# EasyEDA Pro project mipi转接板.eprj

# Schematic Schematic1
Board Name: Board1; Create Date: 2026-05-06; Page Name: P1; Project Name: mipi转接板; Schematic Name: Schematic1; Update Date: 2026-05-06; Company: 嘉立创EDA; Page Size: A4; Version: V1.0
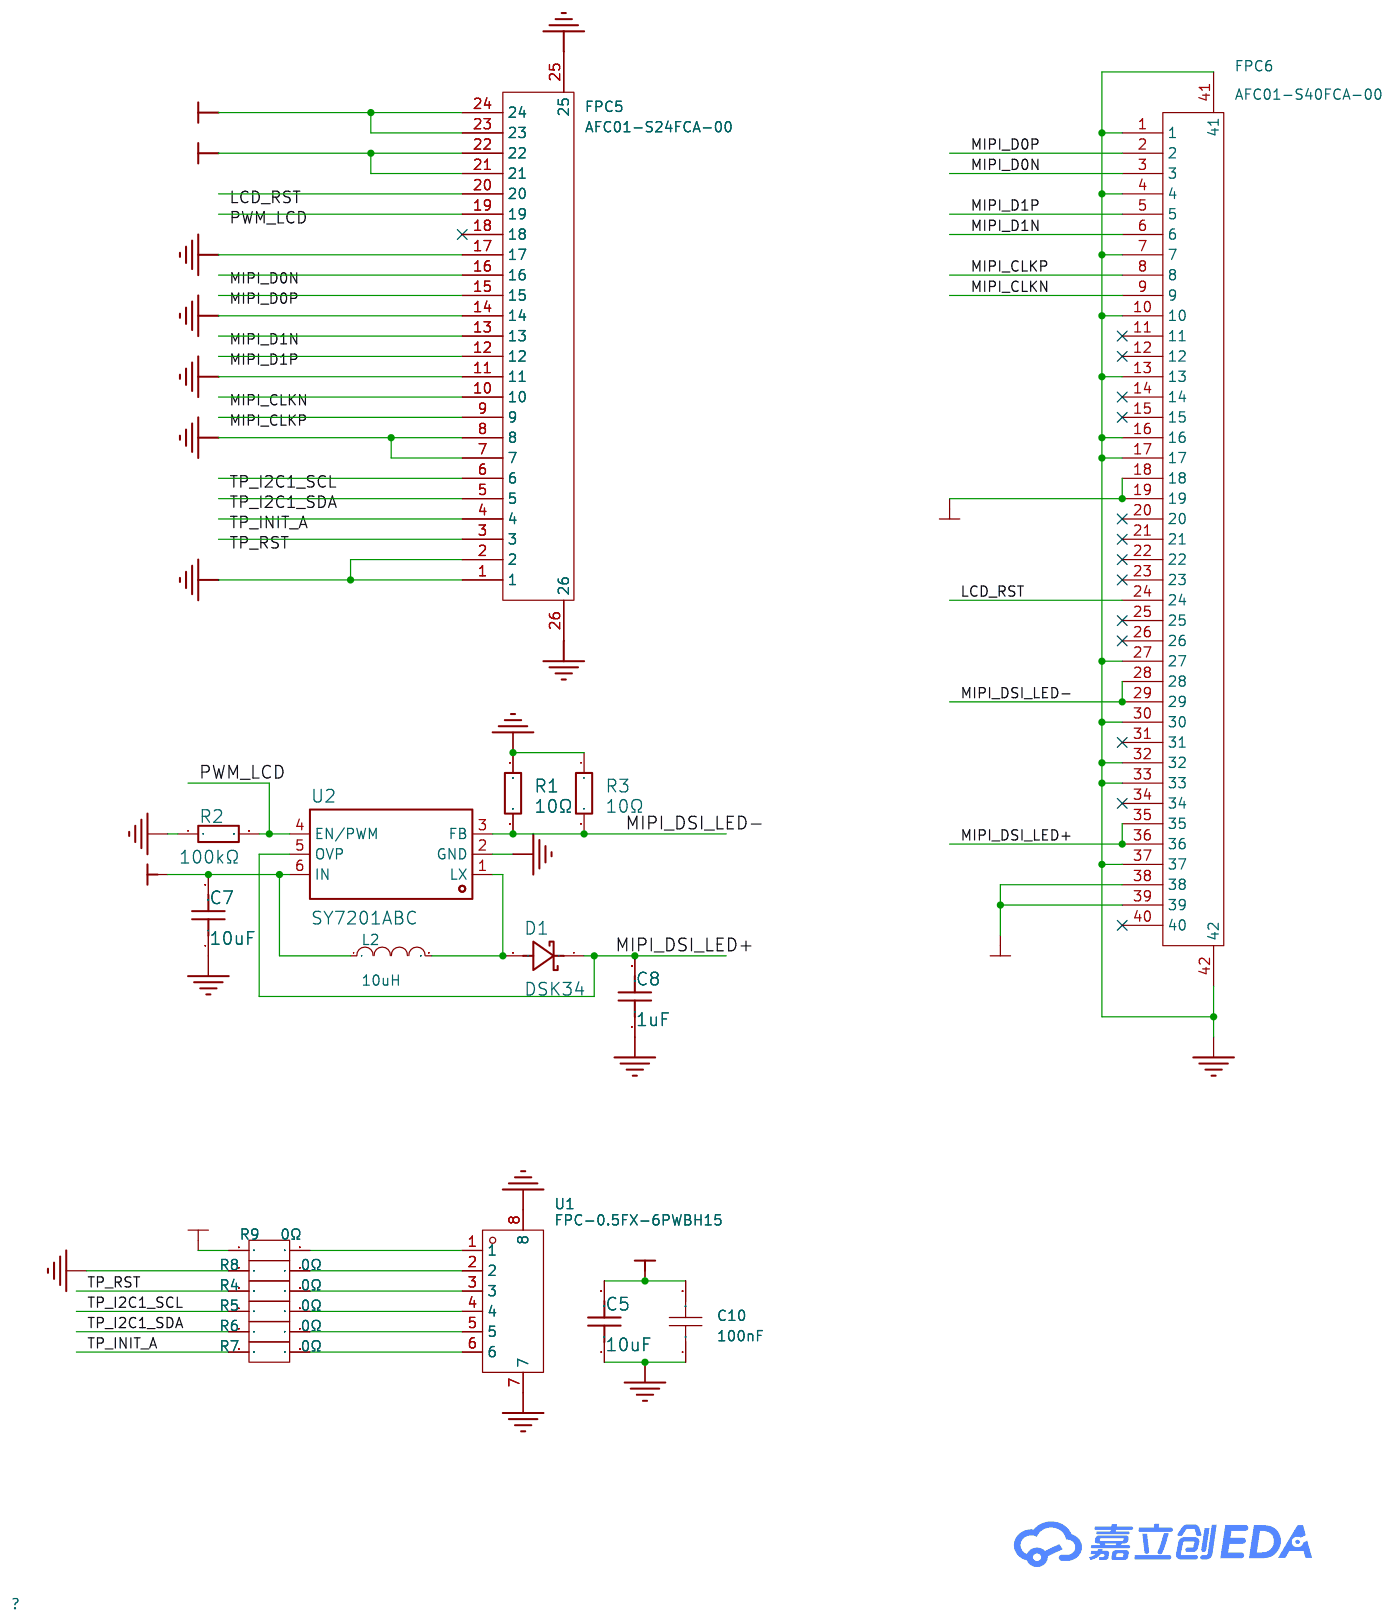
[diagram p0: schematic sheet]

## Parts
C5  10uF  [C0805]
C7  10uF  [C0805]
C8  1uF  [C0805]
C10  100nF  [C0805]
D1  DSK34  [SOD-123_L2.8-W1.8-LS3.7-RD]
FPC5  AFC01-S24FCA-00  [FPC-SMD_24P-P0.50_AFC01-S24FCA-00]
FPC6  AFC01-S40FCA-00  [FPC-SMD_AFC01-S40FCA-00]
L2  10uH  [IND-SMD_L7.3-W6.8]
R1  10Ω  [R0805]
R2  100kΩ  [R0805]
R3  10Ω  [R0805]
R4  0Ω  [R0805]
R5  0Ω  [R0805]
R6  0Ω  [R0805]
R7  0Ω  [R0805]
R8  0Ω  [R0805]
R9  0Ω  [R0805]
U1  FPC-0.5FX-6PWBH15  [FPC-SMD_XUNPU_FPC-0.5FX-6PWBH15]
U2  SY7201ABC  [SOT-23-6_L2.9-W1.6-P0.95-LS2.8-BR]

## Library data of the parts
C5 C7 = CL21A106KAYNNNE_C15850: 容值:10uF;精度:±10%;额定电压:25V;温度系数:X5R;; LCSC Part Name: 10uF ±10% 25V; Supplier Part: C15850; Manufacturer: SAMSUNG(三星); Manufacturer Part: CL21A106KAYNNNE; Supplier Footprint: 0805; JLCPCB Part Class: Basic Part; Datasheet: https://item.szlcsc.com/datasheet/CL21A106KAYNNNE/16532.html; Supplier: LCSC; Tolerance: ±10%; Voltage Rating: 25V; Temperature Coefficient: X5R
C8 = CL21B105KBFNNNE: 容值:1uF;精度:±10%;额定电压:50V;温度系数:X7R;; LCSC Part Name: 1uF ±10% 50V; Supplier Part: C28323; Manufacturer: SAMSUNG(三星); Supplier Footprint: 0805; JLCPCB Part Class: Basic Part; Datasheet: https://item.szlcsc.com/datasheet/CL21B105KBFNNNE/29074.html; Supplier: LCSC; Tolerance: ±10%; Voltage Rated: 50V; Temperature Coefficient: X7R; Voltage Rating: 50V
C10 = C0805S104K5RACAUTO: LCSC Part Name: 100nF ±10% 50V; Supplier Part: C2172699; Manufacturer: KEMET(基美); Supplier Footprint: 0805; JLCPCB Part Class: Extended Part; Datasheet: https://item.szlcsc.com/datasheet/C0805S104K5RACAUTO/2264765.html; Supplier: LCSC; Tolerance: ±10%; Voltage Rating: 50V; Temperature Coefficient: X7R
D1 = DSK34: LCSC Part Name: 电压:40V 电流:3A; Supplier Part: C908230; Manufacturer: FUXINSEMI(富芯森美); Supplier Footprint: SOD-123; JLCPCB Part Class: 扩展库; Datasheet: https://atta.szlcsc.com/upload/public/pdf/source/20201027/C908230_5B73A4E0F076D2A690D7C134AB43D23C.pdf; Supplier: LCSC; Forward Voltage (Vf@If): 550mV@3A; Reverse Voltage (Vr): 40V; Average Rectified Current (Io): 3A; Reverse Leakage Current (Ir): 500nA
FPC5 = AFC01-S24FCA-00: 锁定特性:翻盖式;触点类型:下接;触点数量:24P;间距:0.5mm;安装类型:卧贴;; LCSC Part Name: 间距:0.5mm P数:24P 翻盖式 下接; Supplier Part: C262669; Manufacturer: JS(钜硕电子); Supplier Footprint: SMD,P=0.5mm,卧贴; JLCPCB Part Class: 扩展库; Datasheet: https://atta.szlcsc.com/upload/public/pdf/source/20190816/C413942_2A72D1AC756EAE17EEDF756A339D4500.pdf; Supplier: LCSC; Locking Feature: 翻盖式; Contact Type: 下接; Number of Contacts: 24P; Pitch: 0.5mm; Mounting Type: 卧贴; FFC, FCB Thickness: 0.3mm; Height Above Board: 2mm
FPC6 = AFC01-S40FCA-00: LCSC Part Name: 翻盖式 下接 P数:40P 间距:0.5mm; Supplier Part: C262674; Manufacturer: JS(钜硕电子); Supplier Footprint: SMD,P=0.5mm,卧贴; JLCPCB Part Class: 扩展库; Datasheet: https://item.szlcsc.com/datasheet/AFC01-S40FCA-00/253933.html; Supplier: LCSC; Locking Feature: 翻盖式; Contact Type: 下接; Number of Contacts: 40P; Pitch: 0.5mm; Mounting Type: 卧贴; FFC, FCB Thickness: 0.3mm; Height Above Board: 2mm; Contact Material: 铜合金; Contact Plating: 锡; Operating Temperature: -45℃~+85℃; Rated Voltage (Max): 50V; Current Rating (Max): 500mA
L2 = FXL0630-100-M: 电感值:10uH;精度:±20%;额定电流:4.5A;饱和电流(Isat):5.5A;类型:一体成型电感;; LCSC Part Name: 10uH ±20% 5.5A; Supplier Part: C167223; Manufacturer: cjiang(长江微电); Supplier Footprint: SMD,6.6x7mm; JLCPCB Part Class: 扩展库; Datasheet: https://atta.szlcsc.com/upload/public/pdf/source/20240426/3189EA8206330E2108542F9E34E540E7.pdf; Supplier: LCSC; Tolerance: ±20%; Rated Current: 4.5A; Saturation Current (Isat): 5.5A; DC Resistance (DCR): 68mΩ; Type: 一体成型电感
R1 R3 = 0603WAF360KT5E: LCSC Part Name: 3.6Ω ±1% 100mW 厚膜电阻; Supplier Part: C23015; Manufacturer: UNI-ROYAL(厚声); Supplier Footprint: 0603; JLCPCB Part Class: Extended Part; Datasheet: https://atta.szlcsc.com/upload/public/pdf/source/20200306/C422600_1E6D84923E4A46A82E41ADD87F860B5C.pdf; Supplier: LCSC; Type: 厚膜电阻; Tolerance: ±1%; Power(Watts): 100mW; Overload Voltage (Max): 75V; Temperature Coefficient: ±400ppm/℃; Operating Temperature Range: -55℃~+155℃
R2 = 0805W8F1003T5E: 电阻类型:厚膜电阻;阻值:100kΩ;精度:±1%;功率:125mW;工作电压:150V;温度系数:±100ppm/℃;; LCSC Part Name: 100kΩ ±1% 125mW 厚膜电阻; Supplier Part: C149504; Manufacturer: UNI-ROYAL(厚声); Supplier Footprint: 0805; JLCPCB Part Class: Basic Part; Datasheet: https://item.szlcsc.com/datasheet/0805W8F1003T5E/160838.html; Supplier: LCSC; Type: 厚膜电阻; Tolerance: ±1%; Power(Watts): 125mW; Voltage-Supply(Max): 150V; Temperature Coefficient: ±100ppm/℃; Operating Temperature: -55℃~+155℃
R4-R9 = RE0805FAR000: LCSC Part Name: 0Ω 0.5W 0805 ±1%; Supplier Part: C51934133; Manufacturer: JIERR(捷而瑞); Supplier Footprint: 0805; JLCPCB Part Class: 扩展库; Datasheet: https://item.szlcsc.com/datasheet/RE0805FAR000/54649545.html; Supplier: LCSC; Type: 合金电阻; Tolerance: ±1%; Power(Watts): 500mW; Temperature Coefficient: ±50ppm/℃; Mounting Type: 贴片
U1 = FPC-0.5FX-6PWBH15: LCSC Part Name: 0.5mm P数:6 翻盖式 下接 H1.5; Supplier Part: C3446025; Manufacturer: XUNPU(讯普); Supplier Footprint: SMD,P=0.5mm; Datasheet: https://atta.szlcsc.com/upload/public/pdf/source/20220630/A8197E0740085DD1C1C2DD48EC1382D5.pdf; Supplier: LCSC
U2 = SY7201ABC: 拓扑结构:升压;; Supplier Part: C82173; Manufacturer: Silergy(矽力杰); Supplier Footprint: SOT-23-6; JLCPCB Part Class: Extended Part; Datasheet: https://item.szlcsc.com/datasheet/SY7201ABC/83328.html; Supplier: LCSC; Topology: 升压

## Nets
GND: C5.1 C7.1 C8.1 C10.1 FPC5.1 FPC5.2 FPC5.7 FPC5.8 FPC5.11 FPC5.14 FPC5.17 FPC5.25 FPC5.26 FPC6.1 FPC6.4 FPC6.7 FPC6.10 FPC6.13 FPC6.16 FPC6.17 FPC6.27 FPC6.30 FPC6.32 FPC6.33 FPC6.37 FPC6.41 FPC6.42 R1.1 R2.1 R3.1 R8.1 U1.7 U1.8 U2.2(GND)
VCC_3V3: C5.2 C7.2 C10.2 FPC5.21 FPC5.22 FPC6.18 FPC6.19 FPC6.38 FPC6.39 L2.1 R9.1 U2.6(IN)
VCC_5V: FPC5.23 FPC5.24
LCD_RST: FPC5.20 FPC6.24
MIPI_CLKN: FPC5.10 FPC6.9
MIPI_CLKP: FPC5.9 FPC6.8
MIPI_D0N: FPC5.16 FPC6.3
MIPI_D0P: FPC5.15 FPC6.2
MIPI_D1N: FPC5.13 FPC6.6
MIPI_D1P: FPC5.12 FPC6.5
MIPI_DSI_LED+: C8.2 D1.1(K) FPC6.35 FPC6.36 U2.5(OVP)
MIPI_DSI_LED-: FPC6.28 FPC6.29 R1.2 R3.2 U2.3(FB)
PWM_LCD: FPC5.19 R2.2 U2.4(EN/PWM)
TP_I2C1_SCL: FPC5.6 R5.1
TP_I2C1_SDA: FPC5.5 R6.1
TP_INIT_A: FPC5.4 R7.1
TP_RST: FPC5.3 R4.1
$1N657: D1.2(A) L2.2 U2.1(LX)
$1N1132: R9.2 U1.1
$1N1142: R8.2 U1.2
$1N1152: R7.2 U1.6
$1N1156: R6.2 U1.5
$1N1161: R5.2 U1.4
$1N1166: R4.2 U1.3

Not connected (* = marked no-connect by the designer): FPC5 18*; FPC6 11* 12* 14* 15* 20* 21* 22* 23* 25* 26* 31* 34* 40*

# Board PCB1
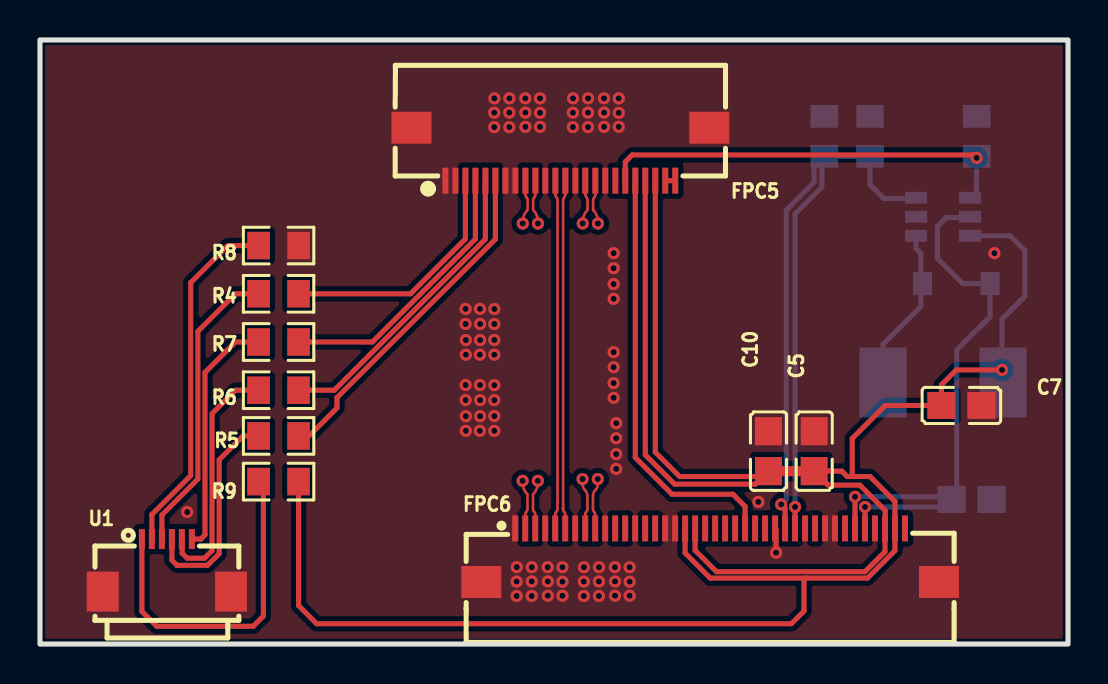
[diagram p1: board, top side]
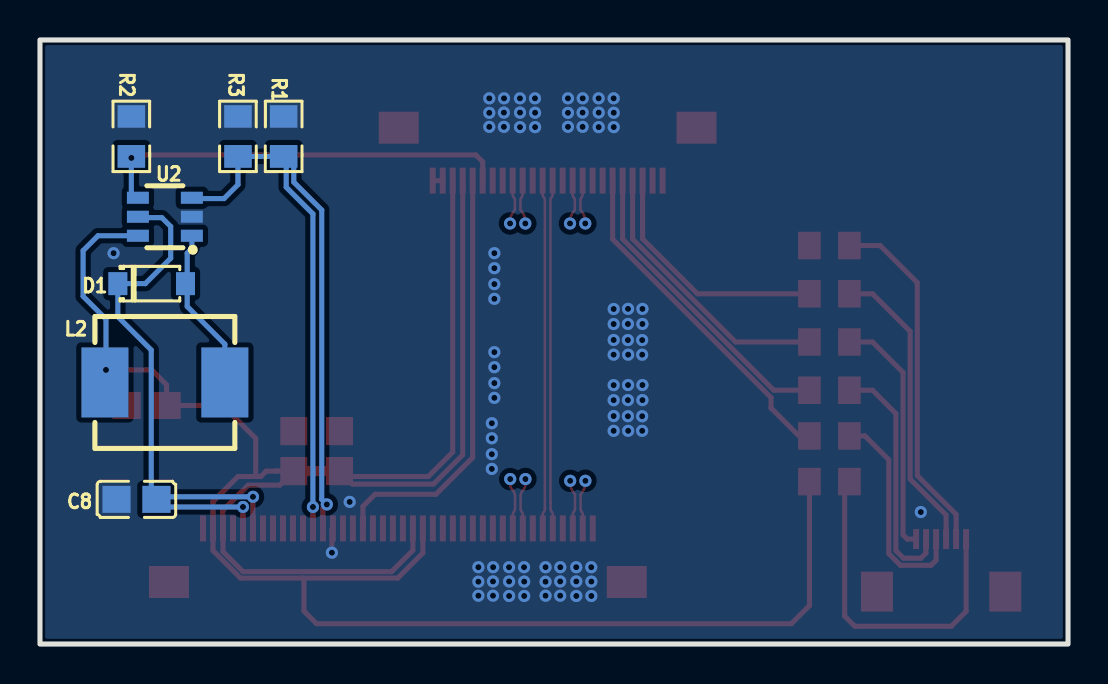
[diagram p2: board, bottom side, seen from below]

Outline 51.44 x 30.23 mm; copper layers: Top Layer, Inner1, Inner2, Bottom Layer. Coordinates in mm from the lower left corner of the outline.
Outline path: rectangle 0,30.23 51.44,0
Stack: Top Layer 0.035mm 外层铜厚1oz / Dielectric1 0.2104mm 7628 RC49% 8.6mil / Inner1 0.0152mm 内层铜厚 / Dielectric2 1.065mm 1.1mm H/HOZ Copper / Inner2 0.0152mm 内层铜厚 / Dielectric3 0.2104mm 7628 RC49% 8.6mil / Bottom Layer 0.035mm 外层铜厚1oz

## Design rules (mm)
net MIPI_CLKP: MIPI_CLK
net MIPI_CLKN: MIPI_CLK
net MIPI_D1P: DP1
net MIPI_D1N: DP1
net MIPI_D0P: MIPI_D0
net MIPI_D0N: MIPI_D0
template: 自定义配置
spacing copperThickness1oz (default): track to track 0.102, other pairs 0.152 to 0.3
spacing copperThickness2oz: track to track 0.203, other pairs 0.152 to 0.3
track width copperThickness1oz (default): min 0.127, default 0.254, max 2.54
track width copperThickness2oz: min 0.203, default 0.254, max 2.54
differential pair differentialPair (default): width min 0.127, default 0.254, max 2.54; gap min 0.152, default 0.152
via viaSize (default): diameter min 0.5, default 0.61, max 10; hole min 0.3, default 0.305, max 6.3

## Placement (name value [footprint] x y rotation side)
C5  10uF  [C0805]  38.73 9.65 270 top
C7  10uF  [C0805]  46.1 11.94 180 top
C8  1uF  [C0805]  46.61 7.24 180 bottom
C10  100nF  [C0805]  36.45 9.65 270 top
D1  DSK34  [SOD-123_L2.8-W1.8-LS3.7-RD]  45.85 18.03 180 bottom
FPC5  AFC01-S24FCA-00  [FPC-SMD_24P-P0.50_AFC01-S24FCA-00]  26.03 24.51 180 top
FPC6  AFC01-S40FCA-00  [FPC-SMD_AFC01-S40FCA-00]  33.53 4.44 0 top
L2  10uH  [IND-SMD_L7.3-W6.8]  45.19 13.09 180 bottom
R1  10Ω  [R0805]  39.24 25.4 270 bottom
R2  100kΩ  [R0805]  46.86 25.4 270 bottom
R3  10Ω  [R0805]  41.53 25.4 270 bottom
R4  0Ω  [R0805]  11.94 17.53 180 top
R5  0Ω  [R0805]  11.94 10.41 180 top
R6  0Ω  [R0805]  11.94 12.7 180 top
R7  0Ω  [R0805]  11.94 15.11 180 top
R8  0Ω  [R0805]  11.94 19.94 180 top
R9  0Ω  [R0805]  11.94 8.13 180 top
U1  FPC-0.5FX-6PWBH15  [FPC-SMD_XUNPU_FPC-0.5FX-6PWBH15]  6.35 3.94 0 top
U2  SY7201ABC  [SOT-23-6_L2.9-W1.6-P0.95-LS2.8-BR]  45.19 21.38 180 bottom

## Footprints (pads in the part's own frame, mm; a bottom-side part is the same pattern mirrored in y, then rotated)
C0805
  rect 1.41x1.35 smd: 1(-1,0) 2(1,0)
FPC-SMD_24P-P0.50_AFC01-S24FCA-00
  rect 0.3x1.3 smd: 1(5.75,1.325) 2(5.25,1.325) 3(4.75,1.325) 4(4.25,1.325) 5(3.75,1.325) 6(3.25,1.325) 7(2.75,1.325) 8(2.25,1.325) 9(1.75,1.325) 10(1.25,1.325) 11(0.75,1.325) 12(0.25,1.325) 13(-0.25,1.325) 14(-0.75,1.325) 15(-1.25,1.325) 16(-1.75,1.325) 17(-2.25,1.325) 18(-2.75,1.325) 19(-3.25,1.325) 20(-3.75,1.325) 21(-4.25,1.325) 22(-4.75,1.325) 23(-5.25,1.325) 24(-5.75,1.325)
  rect 2x1.6 smd: 25(7.449,-1.325) 26(-7.45,-1.325)
FPC-SMD_AFC01-S40FCA-00
  rect 0.3x1.3 smd: 1(-9.75,1.34) 2(-9.25,1.339) 3(-8.75,1.34) 4(-8.25,1.34) 5(-7.75,1.34) 6(-7.25,1.34) 7(-6.75,1.34) 8(-6.25,1.34) 9(-5.75,1.34) 10(-5.25,1.34) 11(-4.75,1.34) 12(-4.25,1.34) 13(-3.75,1.34) 14(-3.25,1.34) 15(-2.75,1.34) 16(-2.25,1.34) 17(-1.75,1.34) 18(-1.25,1.34) 19(-0.75,1.34) 20(-0.25,1.34) 21(0.25,1.34) 22(0.75,1.34) 23(1.25,1.34) 24(1.75,1.34) 25(2.25,1.34) 26(2.75,1.34) 27(3.25,1.34) 28(3.75,1.34) 29(4.25,1.34) 30(4.75,1.34) 31(5.25,1.34) 32(5.75,1.34) 33(6.25,1.34) 34(6.75,1.34) 35(7.25,1.34) 36(7.75,1.34) 37(8.25,1.34) 38(8.75,1.34) 39(9.25,1.34) 40(9.75,1.34)
  rect 2x1.6 smd: 41(-11.45,-1.34) 42(11.45,-1.34)
FPC-SMD_XUNPU_FPC-0.5FX-6PWBH15
  rect 0.3x1 smd: 1(-1.25,1.315) 2(-0.75,1.315) 3(-0.25,1.315) 4(0.25,1.315) 5(0.75,1.315) 6(1.25,1.315)
  rect 1.6x2 smd: 7(3.21,-1.315) 8(-3.21,-1.315)
IND-SMD_L7.3-W6.8
  rect 2.35x3.5 smd: 1(-3,0) 2(3,0)
R0805
  rect 1.133x1.377 smd: 1(-1,0) 2(1,0)
SOD-123_L2.8-W1.8-LS3.7-RD
  rect 0.95x1.15 smd: 1(-1.692,0) 2(1.692,0)
SOT-23-6_L2.9-W1.6-P0.95-LS2.8-BR
  rect 1.1x0.6 smd: 1(1.35,-0.95) 2(1.35,0) 3(1.35,0.95) 4(-1.35,0.95) 5(-1.35,0) 6(-1.35,-0.95)

## Nets
As in the schematic.

Pads without a net: FPC5 18; FPC6 11 12 14 15 20 21 22 23 25 26 31 34 40

## Via types
v1: diameter 0.61, hole 0.305, Top Layer to Bottom Layer, 102 vias

## Routing (per net, layer and track width the routed paths; a pad name or vN(x,y) marks a point on that pad's centre or on a via; arc(x,y) is an arc through that point)
GND: length 1.2
  Top Layer w0.254: FPC6.27 36.83,5.73 v1(36.83,4.57)
  vias: v1(7.37,6.6) v1(21.29,16.77) v1(21.29,16.02) v1(21.31,15.21) v1(21.31,14.48) v1(21.29,12.96) v1(21.29,12.21) v1(21.31,11.4) v1(21.31,10.67) v1(22.01,16.77) v1(22.02,16.02) v1(22.02,15.21) v1(22.01,14.48) v1(22.01,12.96) v1(22.02,12.21) v1(22.02,11.4) v1(22.01,10.67) v1(22.73,26.59) v1(22.73,25.87) v1(22.73,27.31) v1(22.73,16.76) v1(22.73,16.01) v1(22.73,15.22) v1(22.73,14.48) v1(22.73,12.95) v1(22.73,12.2) v1(22.73,11.41) v1(22.73,10.67) v1(23.48,27.31) v1(23.48,26.59) v1(23.48,25.87) v1(23.85,3.84) v1(23.85,3.12) v1(23.85,2.41) v1(24.28,27.31) v1(24.29,26.59) v1(24.29,25.88) v1(24.61,3.84) v1(24.6,3.13) v1(24.6,2.41) v1(25.02,27.31) v1(25.02,26.58) v1(25.02,25.88) v1(25.4,3.84) v1(25.41,3.13) v1(25.41,2.42) v1(26.14,3.84) v1(26.14,3.12) v1(26.14,2.42) v1(26.67,27.31) v1(26.66,26.59) v1(26.66,25.87) v1(27.22,3.84) v1(27.21,3.12) v1(27.21,2.41) v1(27.42,27.31) v1(27.42,26.59) v1(27.42,25.87) v1(27.97,3.84) v1(27.96,3.13) v1(27.96,2.41) v1(28.22,27.31) v1(28.22,26.59) v1(28.22,25.88) v1(28.7,19.56) v1(28.7,18.81) v1(28.7,18.01) v1(28.7,17.27) v1(28.7,14.61) v1(28.7,13.85) v1(28.7,13.06) v1(28.7,12.32) v1(28.83,11.05) v1(28.83,10.3) v1(28.83,9.5) v1(28.83,8.76) v1(28.76,3.84) v1(28.77,3.13) v1(28.77,2.42) v1(28.96,27.31) v1(28.96,26.58) v1(28.96,25.88) v1(29.5,3.84) v1(29.5,3.12) v1(29.5,2.42) v1(35.94,7.11) v1(47.75,19.56)
VCC_3V3: length 134.7
  Top Layer w0.254: FPC6.19 32.78,4.69 33.85,3.62 41.28,3.62 42.28,4.62 FPC6.38 42.29,5.8 42.29,6.68 41.02,7.95 39.44,7.95 C5.2 ; 38.31,3.3 38.23,3.22 38.23,1.65 37.59,1.02 13.84,1.02 12.94,1.92 R9.1 ; 38.31,3.3 41.4,3.3 42.78,4.68 FPC6.39 42.78,7.13 41.53,8.38 40.57,8.38 ; 38.31,3.3 33.53,3.3 32.28,4.55 FPC6.18 ; 40.57,8.38 40.39,8.38 40.12,8.65 39.61,8.65 39.6,8.66 38.74,8.66 ; 40.57,8.38 40.64,8.45 40.64,10.29 42.29,11.94 C7.2 45.1,12.97 45.85,13.72 v1(48.13,13.72) ; FPC5.22 30.78,9.6 32,8.38 36.18,8.38 35.8,8 31.75,8 30.28,9.47 FPC5.21
  Top Layer w0.508: C10.2 C5.2
  Bottom Layer w0.254: v1(48.13,13.72) 48.13,16.26 49.28,17.4 49.28,19.69 48.53,20.43 U2.6
VCC_5V: length 0.5
  Top Layer w0.254: FPC5.23 FPC5.24
LCD_RST: length 21.5
  Top Layer w0.254: FPC6.24 35.28,6.89 34.67,7.49 31.62,7.49 29.78,9.33 FPC5.20
MIPI_CLKN: length 18.8
  Top Layer w0.127: FPC5.10 24.78,22.49 arc(24.77,22.41) 24.73,22.35 arc(24.69,22.29) 24.67,22.22 24.67,21.72 arc(24.85,21.45) 24.92,21.13 v1(24.92,21.04) ; v1(27.91,8.25) 27.91,7.99 arc(27.88,7.84) 27.79,7.7 arc(27.7,7.57) 27.67,7.41 27.67,6.75 arc(27.68,6.68) 27.72,6.62 arc(27.76,6.56) 27.78,6.48 FPC6.9
  Inner1 w0.127: v1(27.91,8.25) 27.91,8.69 arc(27.89,8.8) 27.82,8.9 arc(27.75,9) 27.73,9.12 27.73,9.25 arc(27.76,12.37) 27.69,15.49 arc(27.07,17.44) 25.53,18.8 arc(24.95,19.31) 24.74,20.05 24.74,20.18 arc(24.76,20.3) 24.83,20.4 arc(24.89,20.49) 24.92,20.61 v1(24.92,21.04)
MIPI_CLKP: length 18.8
  Top Layer w0.127: v1(27.15,8.25) 27.15,7.99 arc(27.18,7.84) 27.27,7.7 arc(27.36,7.57) 27.39,7.41 27.39,6.75 arc(27.37,6.68) 27.33,6.62 arc(27.29,6.56) 27.28,6.48 FPC6.8 ; v1(24.15,21.04) 24.15,21.13 arc(24.22,21.45) 24.4,21.72 24.4,22.22 arc(24.38,22.29) 24.34,22.35 arc(24.3,22.41) 24.28,22.49 FPC5.9
  Inner1 w0.127: v1(24.15,21.04) 24.15,20.61 arc(24.18,20.49) 24.24,20.4 arc(24.31,20.3) 24.33,20.18 24.33,20.05 arc(24.61,19.1) 25.35,18.43 arc(26.72,17.22) 27.28,15.48 arc(27.35,12.36) 27.32,9.25 27.32,9.12 arc(27.3,9) 27.24,8.9 arc(27.17,8.8) 27.15,8.69 v1(27.15,8.25)
MIPI_D0N: length 19.2
  Top Layer w0.127: v1(27.92,21.04) 27.92,21.13 arc(27.85,21.45) 27.67,21.72 27.67,22.22 arc(27.69,22.29) 27.73,22.35 arc(27.77,22.41) 27.78,22.49 FPC5.16 ; v1(24.91,8.17) 24.91,8.08 arc(24.85,7.76) 24.67,7.49 24.67,6.75 arc(24.68,6.68) 24.72,6.62 arc(24.76,6.56) 24.78,6.48 FPC6.3
  Inner2 w0.127: v1(24.91,8.17) 24.91,8.6 arc(24.89,8.72) 24.82,8.81 arc(24.75,8.91) 24.73,9.03 24.73,9.16 arc(24.87,12.45) 24.89,15.75 arc(25.18,16.52) 25.91,16.89 arc(27.21,17.56) 27.74,18.92 27.74,20.18 arc(27.76,20.3) 27.83,20.4 arc(27.89,20.49) 27.92,20.61 v1(27.92,21.04)
MIPI_D0P: length 19.2
  Top Layer w0.127: FPC6.2 24.28,6.48 arc(24.29,6.55) 24.33,6.62 arc(24.37,6.68) 24.39,6.75 24.39,7.49 arc(24.21,7.76) 24.15,8.08 v1(24.15,8.17) ; v1(27.15,21.04) 27.15,21.13 arc(27.22,21.45) 27.39,21.72 27.39,22.22 arc(27.38,22.29) 27.34,22.35 arc(27.3,22.41) 27.28,22.49 FPC5.15
  Inner2 w0.127: v1(24.15,8.17) 24.15,8.6 arc(24.17,8.72) 24.24,8.81 arc(24.3,8.91) 24.32,9.03 24.32,9.16 arc(24.47,12.45) 24.49,15.74 arc(24.87,16.79) 25.87,17.3 arc(26.91,17.83) 27.33,18.92 27.33,20.18 arc(27.31,20.3) 27.24,20.4 arc(27.18,20.49) 27.15,20.61 v1(27.15,21.04)
MIPI_D1N: length 17.5
  Top Layer w0.127: FPC5.13 26.28,22.49 arc(26.27,22.41) 26.23,22.35 arc(26.19,22.29) 26.17,22.22 26.17,6.8 arc(26.17,6.8) 26.17,6.8 arc(26.17,6.8) 26.17,6.8 26.17,6.75 arc(26.18,6.68) 26.22,6.62 arc(26.26,6.56) 26.28,6.48 FPC6.6
MIPI_D1P: length 17.5
  Top Layer w0.127: FPC5.12 25.78,22.49 arc(25.8,22.41) 25.84,22.35 arc(25.88,22.29) 25.89,22.22 25.89,7.08 arc(25.89,7.08) 25.89,7.08 arc(25.89,7.08) 25.89,7.08 25.89,6.75 arc(25.87,6.68) 25.83,6.62 arc(25.79,6.56) 25.78,6.48 FPC6.5
MIPI_DSI_LED+: length 30.1
  Top Layer w0.254: FPC6.35 v1(40.78,7.37) ; FPC6.36 v1(41.28,6.86)
  Bottom Layer w0.254: v1(40.78,7.37) 45.48,7.37 45.5,7.35 ; U2.5 46.49,21.34 45.34,21.34 44.89,20.89 44.89,19.3 46.16,18.03 D1.1 47.54,16.38 45.87,14.71 45.87,7.72 45.5,7.35 ; 45.5,7.35 45.01,6.86 v1(41.28,6.86) ; 45.5,7.35 C8.2
MIPI_DSI_LED-: length 44.9
  Top Layer w0.254: v1(37.08,6.98) 37.28,6.79 FPC6.28 ; FPC6.29 v1(37.78,6.86)
  Bottom Layer w0.254: 39.12,24.27 38.73,23.89 38.73,23.11 37.34,21.72 37.34,7.24 v1(37.08,6.98) ; 39.12,24.27 R1.2 R3.2 41.53,22.99 42.23,22.29 43.79,22.29 U2.3 ; 39.12,24.27 39.12,22.86 37.78,21.52 v1(37.78,6.86)
PWM_LCD: length 21
  Top Layer w0.254: v1(46.86,24.33) 46.71,24.47 29.63,24.47 29.28,24.13 FPC5.19
  Bottom Layer w0.254: U2.4 46.71,22.33 46.86,22.48 R2.2
TP_I2C1_SCL: length 16.6
  Top Layer w0.254: 13.46,10.41 14.86,11.81 14.86,12.33 22.78,20.26 FPC5.6
TP_I2C1_SDA: length 15.4
  Top Layer w0.254: FPC5.5 22.28,20.26 14.72,12.7 R6.1
TP_INIT_A: length 13.9
  Top Layer w0.254: FPC5.4 21.78,20.27 16.63,15.11 R7.1
TP_RST: length 12.4
  Top Layer w0.254: R4.1 18.54,17.53 21.28,20.27 FPC5.3
$1N657: length 8.2
  Bottom Layer w0.254: U2.1 43.84,19.79 44.07,19.56 44.07,16.89 42.19,15.01 L2.2
$1N1132: length 17
  Top Layer w0.254: R9.2 11.18,7.89 11.18,1.4 10.67,0.89 5.84,0.89 5.1,1.63 U1.1
$1N1142: length 17.8
  Top Layer w0.254: U1.2 5.6,6.49 7.54,8.43 7.54,18.08 9.4,19.94 R8.2
$1N1152: length 12.2
  Top Layer w0.254: R7.2 9.78,15.11 8.25,13.59 8.25,5.46 8.05,5.25 U1.6
$1N1156: length 12.1
  Top Layer w0.254: R6.2 9.78,12.7 8.61,11.53 8.61,4.67 8.23,4.29 7.37,4.29 7.11,4.55 7.11,5.24 U1.5
$1N1161: length 10.9
  Top Layer w0.254: R5.2 10.16,10.41 8.97,9.22 8.97,4.52 8.38,3.94 6.86,3.94 6.6,4.19 U1.4
$1N1166: length 15
  Top Layer w0.254: R4.2 9.78,17.53 7.9,15.65 7.9,8.25 6.1,6.46 U1.3

## Copper pours and planes (outline as drawn; the poured copper is in the pictures)
GND on Top Layer: 0,30.23 51.44,30.23 51.44,0 0,0
GND on Bottom Layer: 0,30.23 51.44,30.23 51.44,0 0,0
GND on Inner1: 0,30.23 51.44,30.23 51.44,0 0,0
GND on Inner1: 0,30.23 51.44,30.23 51.44,0 0,0
GND on Inner2: 0,30.23 51.44,30.23 51.44,0 0,0
GND on Inner2: 0,30.23 51.44,30.23 51.44,0 0,0
